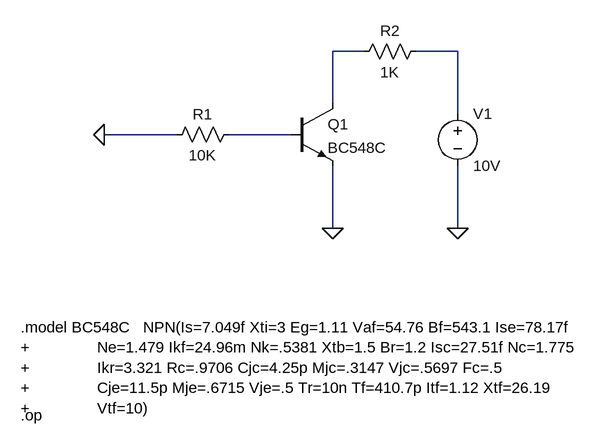
[diagram p0: schematic ej1.asc]
ej1.asc, the LTspice schematic file:
Version 4.1
SHEET 1 880 680
WIRE 400 48 352 48
WIRE 544 48 480 48
WIRE 352 128 352 48
WIRE 544 144 544 48
WIRE 112 176 0 176
WIRE 288 176 192 176
WIRE 352 320 352 224
WIRE 544 320 544 224
FLAG 352 320 0
FLAG 544 320 0
FLAG 0 176 0
SYMBOL res 208 160 R90
WINDOW 0 0 56 VBottom 2
WINDOW 3 32 56 VTop 2
SYMATTR InstName R1
SYMATTR Value 10K
SYMBOL npn 288 128 R0
SYMATTR InstName Q1
SYMATTR Value BC548C
SYMBOL res 496 32 R90
WINDOW 0 0 56 VBottom 2
WINDOW 3 32 56 VTop 2
SYMATTR InstName R2
SYMATTR Value 1K
SYMBOL voltage 544 128 R0
WINDOW 123 0 0 Left 0
WINDOW 39 0 0 Left 0
SYMATTR InstName V1
SYMATTR Value 10V
TEXT -128 472 Left 2 !.model BC548C   NPN(Is=7.049f Xti=3 Eg=1.11 Vaf=54.76 Bf=543.1 Ise=78.17f\n+               Ne=1.479 Ikf=24.96m Nk=.5381 Xtb=1.5 Br=1.2 Isc=27.51f Nc=1.775\n+               Ikr=3.321 Rc=.9706 Cjc=4.25p Mjc=.3147 Vjc=.5697 Fc=.5\n+               Cje=11.5p Mje=.6715 Vje=.5 Tr=10n Tf=410.7p Itf=1.12 Xtf=26.19\n+               Vtf=10)
TEXT -128 608 Left 2 !.op

The netlist it stands for:
* ej1.asc
R1 N003 0 10K
Q1 N001 N003 0 0 BC548C
R2 N002 N001 1K
V1 N002 0 10V
.model NPN NPN
.model PNP PNP
.lib standard.bjt
.model BC548C   NPN(Is=7.049f Xti=3 Eg=1.11 Vaf=54.76 Bf=543.1 Ise=78.17f
+               Ne=1.479 Ikf=24.96m Nk=.5381 Xtb=1.5 Br=1.2 Isc=27.51f Nc=1.775
+               Ikr=3.321 Rc=.9706 Cjc=4.25p Mjc=.3147 Vjc=.5697 Fc=.5
+               Cje=11.5p Mje=.6715 Vje=.5 Tr=10n Tf=410.7p Itf=1.12 Xtf=26.19
+               Vtf=10)
.op
.backanno
.end